# EAGLE design Fan-Module_80mm (EAGLE 9.2.2)
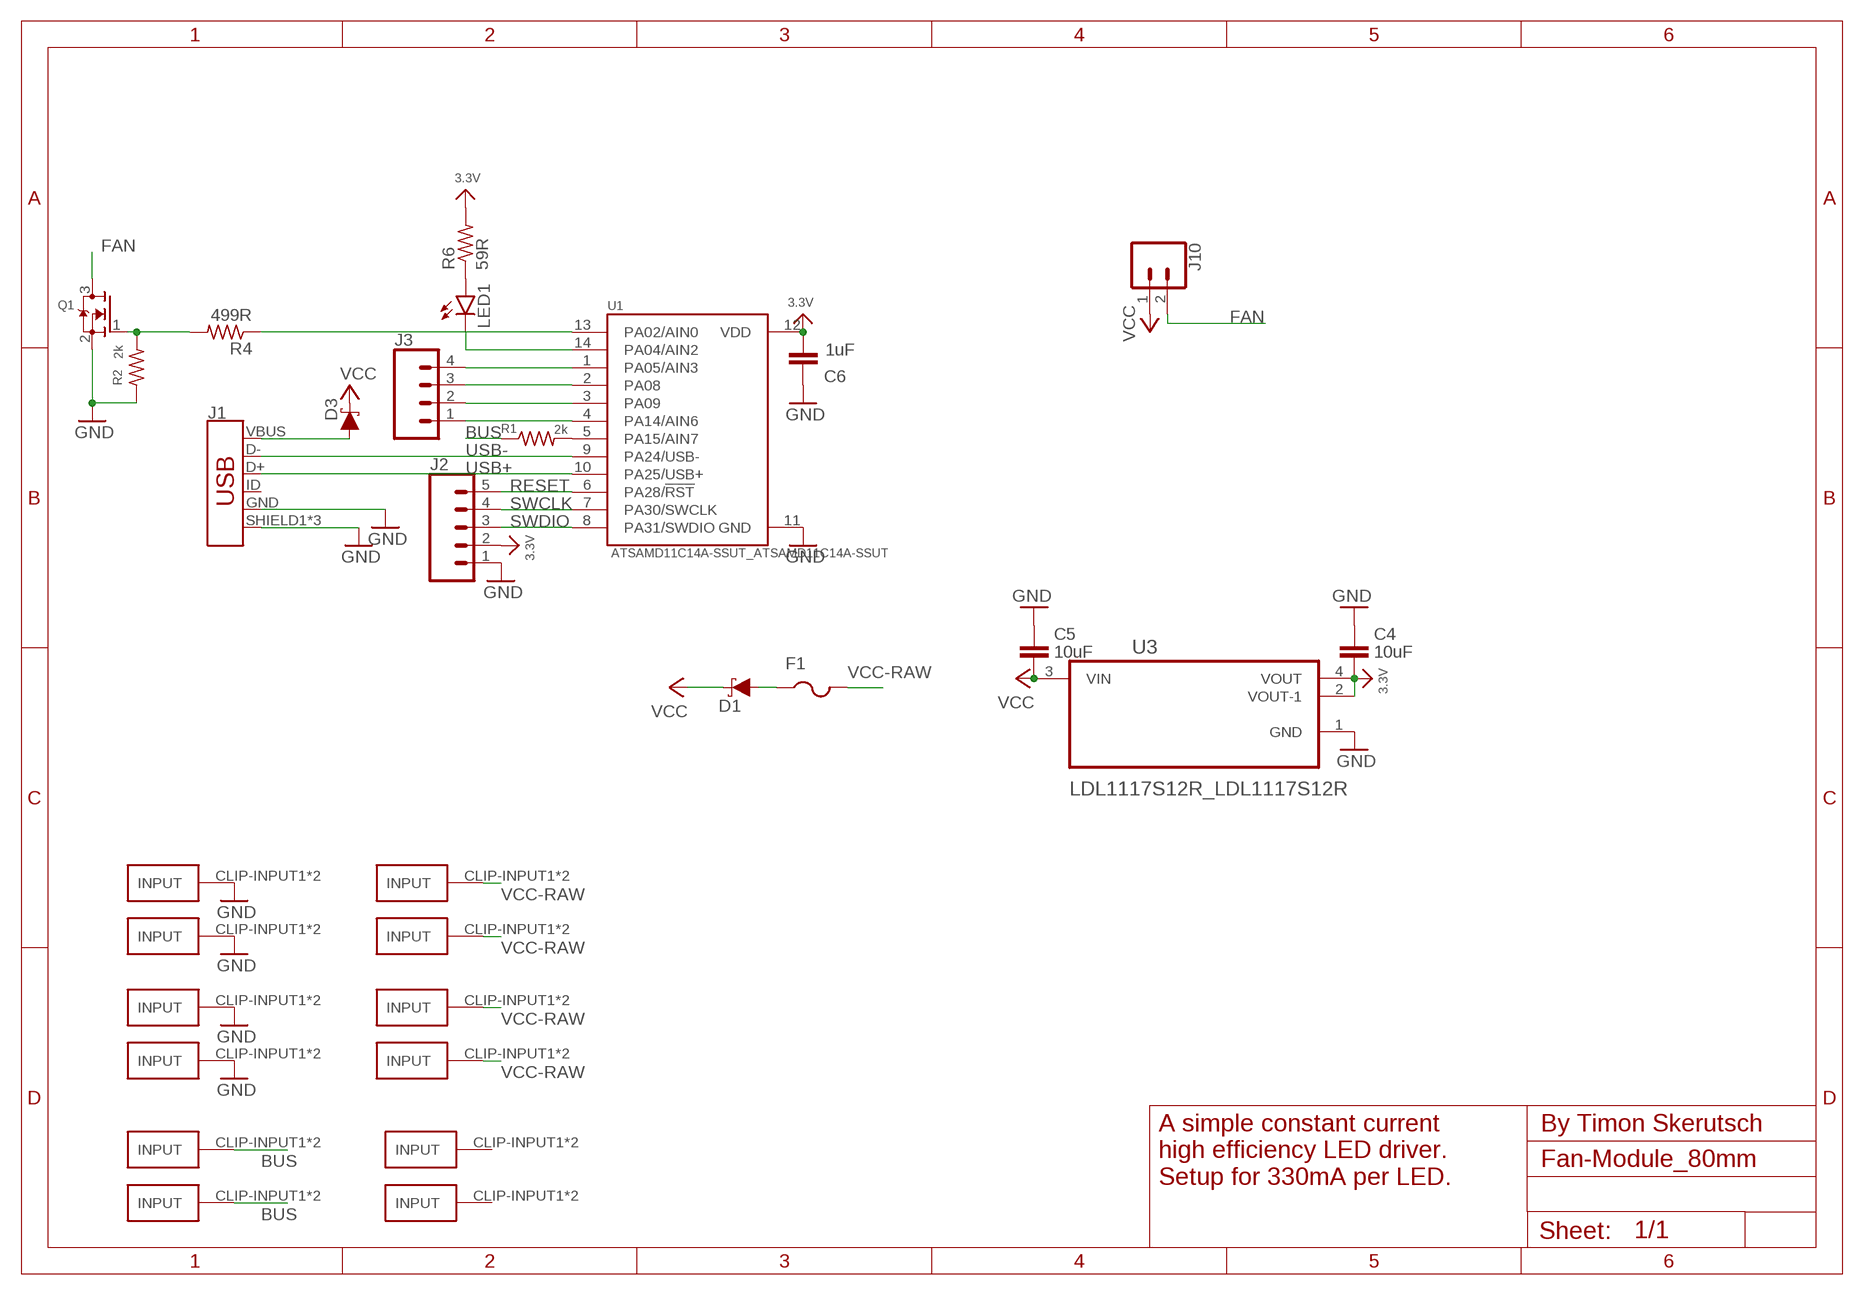
[diagram p0: schematic, sheet 1]

## Parts
C4  10uF  C-EUC0603  [C0603]
C5  10uF  C-EUC0603  [C0603]
C6  1uF  C-EUC0603  [C0603]
D1  3A/40V/500mV  DIODE-SCHOTTKY-B340A  [SMA-DIODE]
D3  3A/40V/500mV  DIODE-SCHOTTKY-B340A  [SMA-DIODE]
F1  PTCFUSE-1812  [1812]
GND-CLIP  FUSE-HOLDER-5X20MM  [FUSE-HOLDER-5X20MM]
GND-CLIP1  FUSE-HOLDER-5X20MM  [FUSE-HOLDER-5X20MM]
GND-CLIP2  FUSE-HOLDER-5X20MM  [FUSE-HOLDER-5X20MM]
GND-CLIP3  FUSE-HOLDER-5X20MM  [FUSE-HOLDER-5X20MM]
J1  USB_MICRO-B_FEMALE-SMT  [USB-B-MICRO-SMD]
J2  CONN_05  [1X05]
J3  CONN_04PTH  [1X04]
J10  CONN_02PTH3  [1X02_LONGPADS]
LED1  LEDCHIPLED_0805  [CHIPLED_0805]
PWM-CLIP  FUSE-HOLDER-5X20MM  [FUSE-HOLDER-5X20MM]
PWM-CLIP1  FUSE-HOLDER-5X20MM  [FUSE-HOLDER-5X20MM]
PWM-CLIP2  FUSE-HOLDER-5X20MM  [FUSE-HOLDER-5X20MM]
PWM-CLIP3  FUSE-HOLDER-5X20MM  [FUSE-HOLDER-5X20MM]
Q1  MOSFET-NWIDE  [SOT23-WIDE]
R1  2k  R-US_R1206  [R1206]
R2  2k  R-US_R1206  [R1206]
R4  499R  R-US_R0805  [R0805]
R6  59R  R-US_R0805  [R0805]
U1  ATSAMD11C14A-SSUT_ATSAMD11C14A-SSUT  [ATSAMD11C14A-SSUT_SOIC127P600X160-14N]
U3  LDL1117S12R_LDL1117S12R  [LDL1117S12R_SOT230P700X180-4N]
VCC-CLIP  FUSE-HOLDER-5X20MM  [FUSE-HOLDER-5X20MM]
VCC-CLIP1  FUSE-HOLDER-5X20MM  [FUSE-HOLDER-5X20MM]
VCC-CLIP2  FUSE-HOLDER-5X20MM  [FUSE-HOLDER-5X20MM]
VCC-CLIP3  FUSE-HOLDER-5X20MM  [FUSE-HOLDER-5X20MM]

## Nets
3.3V: C4.2 C6.2 J2.2 R6.2 U1.12(VDD) U3.2(VOUT-1) U3.4(VOUT)
BUS: PWM-CLIP1.CLIP-INPUT1(INPUT) PWM-CLIP1.CLIP-INPUT2(INPUT) PWM-CLIP.CLIP-INPUT1(INPUT) PWM-CLIP.CLIP-INPUT2(INPUT) R1.1
FAN: J10.2 Q1.3(D)
GND: C4.1 C5.1 C6.1 GND-CLIP1.CLIP-INPUT1(INPUT) GND-CLIP1.CLIP-INPUT2(INPUT) GND-CLIP2.CLIP-INPUT1(INPUT) GND-CLIP2.CLIP-INPUT2(INPUT) GND-CLIP3.CLIP-INPUT1(INPUT) GND-CLIP3.CLIP-INPUT2(INPUT) GND-CLIP.CLIP-INPUT1(INPUT) GND-CLIP.CLIP-INPUT2(INPUT) J1.GND J1.SHIELD1(SHIELD) J1.SHIELD2(SHIELD) J1.SHIELD3(SHIELD) J2.1 Q1.2(S) R2.1 U1.11(GND) U3.1(GND)
N$1: LED1.C U1.14(PA04/AIN2)
N$2: LED1.A R6.1
N$3: R1.2 U1.5(PA15/AIN7)
N$4: D3.A J1.VBUS
N$5: R4.1 U1.13(PA02/AIN0)
N$6: D1.A F1.1
N$7: J3.4 U1.1(PA05/AIN3)
N$8: Q1.1(G) R2.2 R4.2
N$9: J3.3 U1.2(PA08)
N$10: J3.2 U1.3(PA09)
N$11: J3.1 U1.4(PA14/AIN6)
RESET: J2.5 U1.6(PA28/!RST)
SWCLK: J2.4 U1.7(PA30/SWCLK)
SWDIO: J2.3 U1.8(PA31/SWDIO)
USB+: J1.D+ U1.10(PA25/USB+)
USB-: J1.D- U1.9(PA24/USB-)
VCC: C5.2 D1.C D3.C J10.1 U3.3(VIN)
VCC-RAW [VCC]: F1.2 VCC-CLIP1.CLIP-INPUT1(INPUT) VCC-CLIP1.CLIP-INPUT2(INPUT) VCC-CLIP2.CLIP-INPUT1(INPUT) VCC-CLIP2.CLIP-INPUT2(INPUT) VCC-CLIP3.CLIP-INPUT1(INPUT) VCC-CLIP3.CLIP-INPUT2(INPUT) VCC-CLIP.CLIP-INPUT1(INPUT) VCC-CLIP.CLIP-INPUT2(INPUT)
Unconnected: J1.ID PWM-CLIP2.CLIP-INPUT1(INPUT) PWM-CLIP2.CLIP-INPUT2(INPUT) PWM-CLIP3.CLIP-INPUT1(INPUT) PWM-CLIP3.CLIP-INPUT2(INPUT)

## Notes on the sheet
- By Timon Skerutsch
- A simple constant current
  high efficiency LED driver.
  Setup for 330mA per LED.

## Library data of the parts
C4-C6 = rcl:C-EU: CAPACITOR, European symbol; SPICEPREFIX: C
D1 D3 = SparkFun-DiscreteSemi:DIODE-SCHOTTKY: Schottky diode A Schottky diode is a semiconductor diode which has a low forward voltage drop and a very fast switching action.; PROD_ID: DIO-09886
F1 = adafruit:PTCFUSE: PTC fuses, resettable thermistors
GND-CLIP GND-CLIP1-GND-CLIP3 PWM-CLIP PWM-CLIP1-PWM-CLIP3 VCC-CLIP VCC-CLIP1-VCC-CLIP3 = timon-diverses:FUSE-HOLDER-5X20MM
J1 = SparkFun-Connectors:USB_MICRO-B: USB Type Micro-B Connector Male/female and PTH/SMT variants SparkFun Products: SparkFun microB USB Breakout <https://www.sparkfun.com/products/12035> SparkFun USB microB Plug Breakout <https://www.sparkfun.com/products/10031> SparkFun ESP8266 Thing <https://www.sparkfun.com/products/13231>; PROD_ID: CONN-11752
J2 = SparkFun-Connectors:CONN_05: Multi connection point. Often used as Generic Header-pin footprint for 0.1 inch spaced/style header connections On any of the 0.1 inch spaced packages, you can populate with these: Break Away Headers - Straight <https://www.sparkfun.com/products/116> (PRT-00116) Break Away Male Headers - Right Angle <https://www.sparkfun.com/products/553> (PRT-00553) Female Headers <https://www.sparkfun.com/products/115> (PRT-00115) Break Away Headers - Machine Pin <https://www.sparkfun.com/products/117> (PRT-00117) Break Away Female Headers - Swiss Machine Pin <https://www.sparkfun.com/products/743> (PRT-00743) For SCREWTERMINALS and SPRING TERMINALS visit here: Screw Terimnals on SparkFun.com <https://www.sparkfun.com/search/results?term=Screw+Terminals> (5mm/3.5mm/2.54mm spacing) This device is also useful as a general connection point to wire up your design to another part of your project. Our various solder wires solder well into these plated through hole pads. Hook-Up Wire - Assortment (Stranded, 22 AWG) <https://www.sparkfun.com/products/11375> (PRT-11375) Hook-Up Wire - Assortment (Solid Core, 22 AWG) <https://www.sparkfun.com/products/11367> (PRT-11367) View the entire wire category on our website here <https://www.sparkfun.com/categories/141> Special notes: Molex polarized connector foot print use with SKU : PRT-08231 with associated crimp pins and housings. 1MM SMD Version SKU: PRT-10208
J3 = SparkFun-Connectors:CONN_04: Multi connection point. Often used as Generic Header-pin footprint for 0.1 inch spaced/style header connections On any of the 0.1 inch spaced packages, you can populate with these: Break Away Headers - Straight <https://www.sparkfun.com/products/116> (PRT-00116) Break Away Male Headers - Right Angle <https://www.sparkfun.com/products/553> (PRT-00553) Female Headers <https://www.sparkfun.com/products/115> (PRT-00115) Break Away Headers - Machine Pin <https://www.sparkfun.com/products/117> (PRT-00117) Break Away Female Headers - Swiss Machine Pin <https://www.sparkfun.com/products/743> (PRT-00743) For SCREWTERMINALS and SPRING TERMINALS visit here: Screw Terimnals on SparkFun.com <https://www.sparkfun.com/search/results?term=Screw+Terminals> (5mm/3.5mm/2.54mm spacing) This device is also useful as a general connection point to wire up your design to another part of your project. Our various solder wires solder well into these plated through hole pads. Hook-Up Wire - Assortment (Stranded, 22 AWG) <https://www.sparkfun.com/products/11375> (PRT-11375) Hook-Up Wire - Assortment (Solid Core, 22 AWG) <https://www.sparkfun.com/products/11367> (PRT-11367) View the entire wire category on our website here <https://www.sparkfun.com/categories/141> Special notes: Molex polarized connector foot print use with SKU : PRT-08231 with associated crimp pins and housings. 1MM SMD Version SKU: PRT-10208; PROD_ID: CONN-09696
J10 = SparkFun-Connectors:CONN_02: Multi connection point. Often used as Generic Header-pin footprint for 0.1 inch spaced/style header connections On any of the 0.1 inch spaced packages, you can populate with these: Break Away Headers - Straight <https://www.sparkfun.com/products/116> (PRT-00116) Break Away Male Headers - Right Angle <https://www.sparkfun.com/products/553> (PRT-00553) Female Headers <https://www.sparkfun.com/products/115> (PRT-00115) Break Away Headers - Machine Pin <https://www.sparkfun.com/products/117> (PRT-00117) Break Away Female Headers - Swiss Machine Pin <https://www.sparkfun.com/products/743> (PRT-00743) For SCREWTERMINALS and SPRING TERMINALS visit here: Screw Terimnals on SparkFun.com <https://www.sparkfun.com/search/results?term=Screw+Terminals> (5mm/3.5mm/2.54mm spacing) This device is also useful as a general connection point to wire up your design to another part of your project. Our various solder wires solder well into these plated through hole pads. Hook-Up Wire - Assortment (Stranded, 22 AWG) <https://www.sparkfun.com/products/11375> (PRT-11375) Hook-Up Wire - Assortment (Solid Core, 22 AWG) <https://www.sparkfun.com/products/11367> (PRT-11367) View the entire wire category on our website here <https://www.sparkfun.com/categories/141> Special notes: Molex polarized connector foot print use with: PRT-08233 with associated crimp pins and housings. 2.54_SCREWTERM for use with PRT-10571. 3.5mm Screw Terminal footprints for PRT-08084 5mm Screw Terminal footprints for use with PRT-08432
LED1 = led:LED: LED OSRAM: - CHIPLED LG R971, LG N971, LY N971, LG Q971, LY Q971, LO R971, LY R971 LH N974, LH R974 LS Q976, LO Q976, LY Q976 LO Q996 - Hyper CHIPLED LW Q18S LB Q993, LB Q99A, LB R99A - SideLED LS A670, LO A670, LY A670, LG A670, LP A670 LB A673, LV A673, LT A673, LW A673 LH A674 LY A675 LS A676, LA A676, LO A676, LY A676, LW A676 LS A679, LY A679, LG A679 - Hyper Micro SIDELED® LS Y876, LA Y876, LO Y876, LY Y876 LT Y87S - SmartLED LW L88C, LW L88S LB L89C, LB L89S, LG L890 LS L89K, LO L89K, LY L89K LS L896, LA L896, LO L896, LY L896 - TOPLED LS T670, LO T670, LY T670, LG T670, LP T670 LSG T670, LSP T670, LSY T670, LOP T670, LYG T670 LG T671, LOG T671, LSG T671 LB T673, LV T673, LT T673, LW T673 LH T674 LS T676, LA T676, LO T676, LY T676, LB T676, LH T676, LSB T676, LW T676 LB T67C, LV T67C, LT T67C, LS T67K, LO T67K, LY T67K, LW E67C LS E67B, LA E67B, LO E67B, LY E67B, LB E67C, LV E67C, LT E67C LW T67C LS T679, LY T679, LG T679 LS T770, LO T770, LY T770, LG T770, LP T770 LB T773, LV T773, LT T773, LW T773 LH T774 LS E675, LA E675, LY E675, LS T675 LS T776, LA T776, LO T776, LY T776, LB T776 LHGB T686 LT T68C, LB T68C - Hyper Mini TOPLED® LB M676 - Mini TOPLED Santana® LG M470 LS M47K, LO M47K, LY M47K Source: http://www.osram.convergy.de LUXEON: - LUMILED® LXK2-PW12-R00, LXK2-PW12-S00, LXK2-PW14-U00, LXK2-PW14-V00 LXK2-PM12-R00, LXK2-PM12-S00, LXK2-PM14-U00 LXK2-PE12-Q00, LXK2-PE12-R00, LXK2-PE12-S00, LXK2-PE14-T00, LXK2-PE14-U00 LXK2-PB12-K00, LXK2-PB12-L00, LXK2-PB12-M00, LXK2-PB14-N00, LXK2-PB14-P00, LXK2-PB14-Q00 LXK2-PR12-L00, LXK2-PR12-M00, LXK2-PR14-Q00, LXK2-PR14-R00 LXK2-PD12-Q00, LXK2-PD12-R00, LXK2-PD12-S00 LXK2-PH12-R00, LXK2-PH12-S00 LXK2-PL12-P00, LXK2-PL12-Q00, LXK2-PL12-R00 Source: www.luxeon.com KINGBRIGHT: KA-3528ASYC Source: www.kingbright.com
Q1 = microbuilder:MOSFET-N: N-Channel Mosfet LEGEND VDS: Voltage Drain-Source ID: Drain Current RDS(ON): Drain-Source On-State Resistance VGS(TH): Gate-Source Threshold Voltage CISS: Drain-Source Input Capacitance SOT-23 Name VDS ID RDS(ON) VGS(TH) CISS Order Number 2N7002E 60V 260mA 2.5 Ohm 2.5V @ 250uA 26.7pF @ 25V 2N7002ET1GOSTR-ND BSH103 30V 850mA 400 mOhm 400mV @ 1mA 83pF @ 24V BSH103,235-ND BSS138 60V 320mA 1.6 Ohm 1.5V @ 250uA 50pF @ 10V Mouser: 771-BSS138PW115 DMN2075U-7 20V 4.2A 38 mOhm 1V @ 250 uA 594.3pF @ 10V DMN2075U-7DICT-ND * BSS138 good choice for I2C level-shifting
R1 R2 R4 R6 = rcl:R-US_: RESISTOR, American symbol; SPICEPREFIX: R
U1 = LED-Board:ATSAMD11C14A-SSUT_ATSAMD11C14A-SSUT: MCU 32-Bit SAM D11 ARM Cortex M0+ RISC 16KB Flash 1.8V/2.5V/3.3V 14-Pin SOIC T/R; AVAILABILITY: Good; DESCRIPTION: Cortex-M0+, 16KB FLASH, 4KB SRAM, USB - 14 SOIC, INDUSTRIAL, GREEN, 1.6-3.6V, 48MHz/ SOIC .150 (SS); MF: Microchip; MP: ATSAMD11C14A-SSUT; PACKAGE: SOIC-14 Microchip; PRICE: 1.18 USD
U3 = LDL1117S12R:LDL1117S12R_LDL1117S12R: None; AVAILABILITY: Good; DESCRIPTION: 1.2 A High PSRR low dropout linear voltage regulator; MF: STMicroelectronics; MP: LDL1117S12R; PACKAGE: SOT-223 STMicroelectronics; PRICE: 0.22 USD

## Net classes
1 VCC: clearance 0.508 mm

## Board
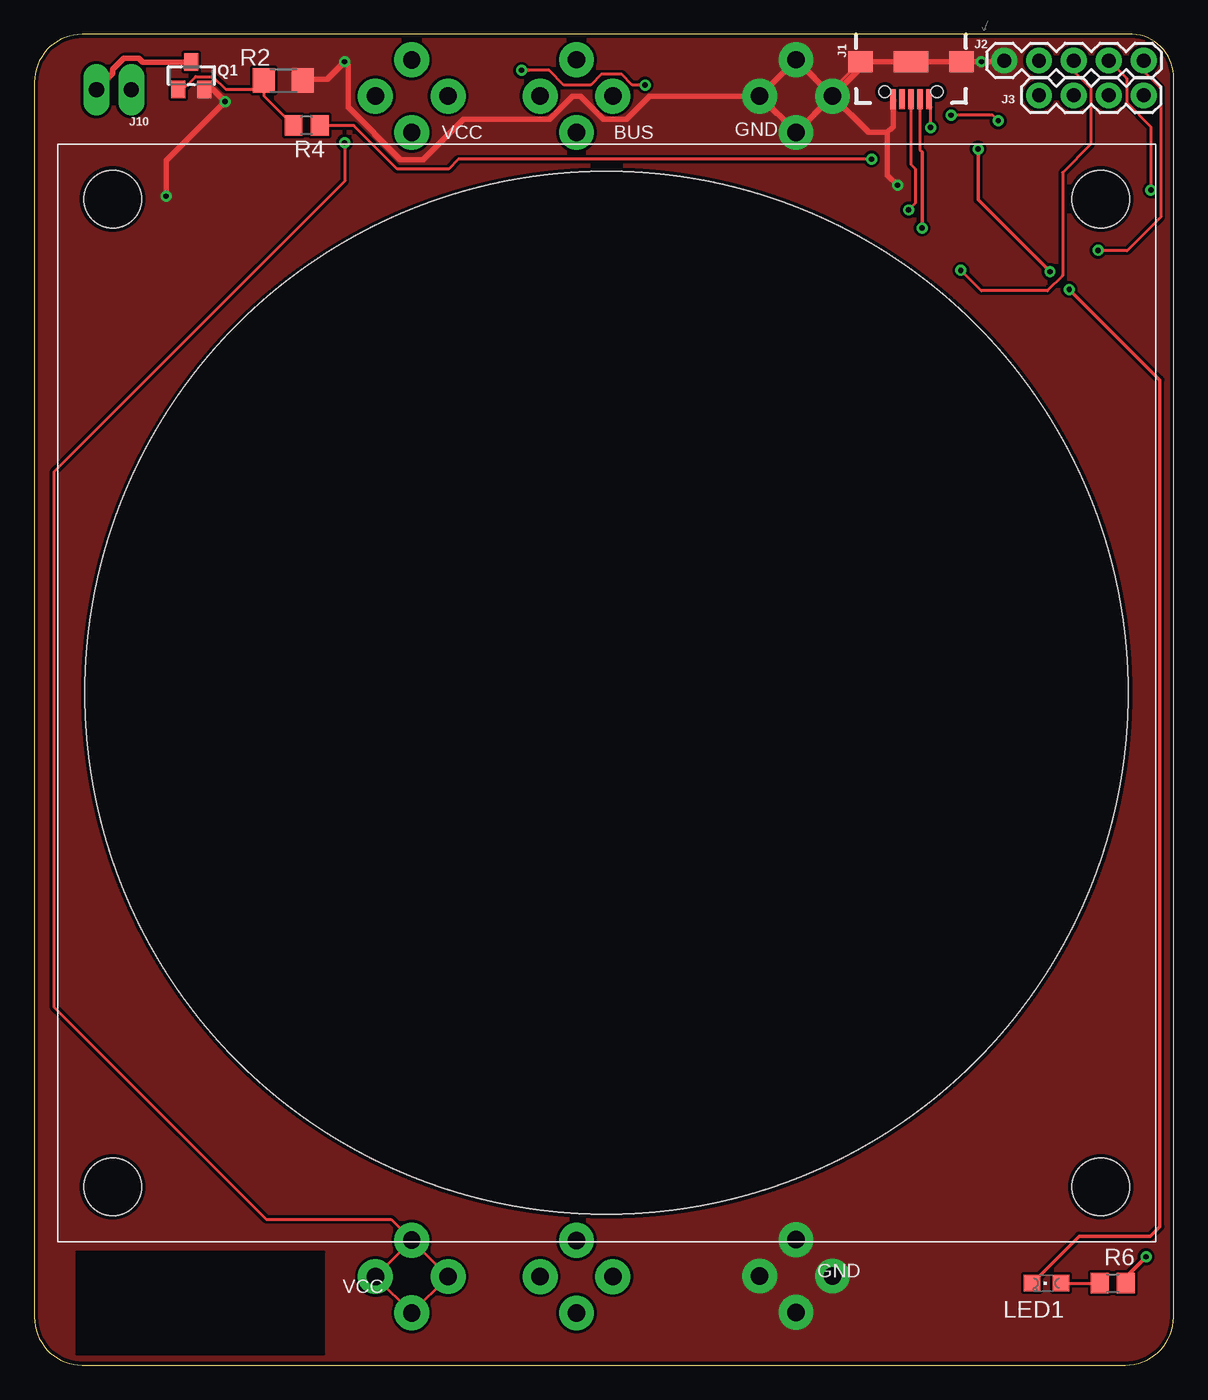
[diagram p1: board, top side]
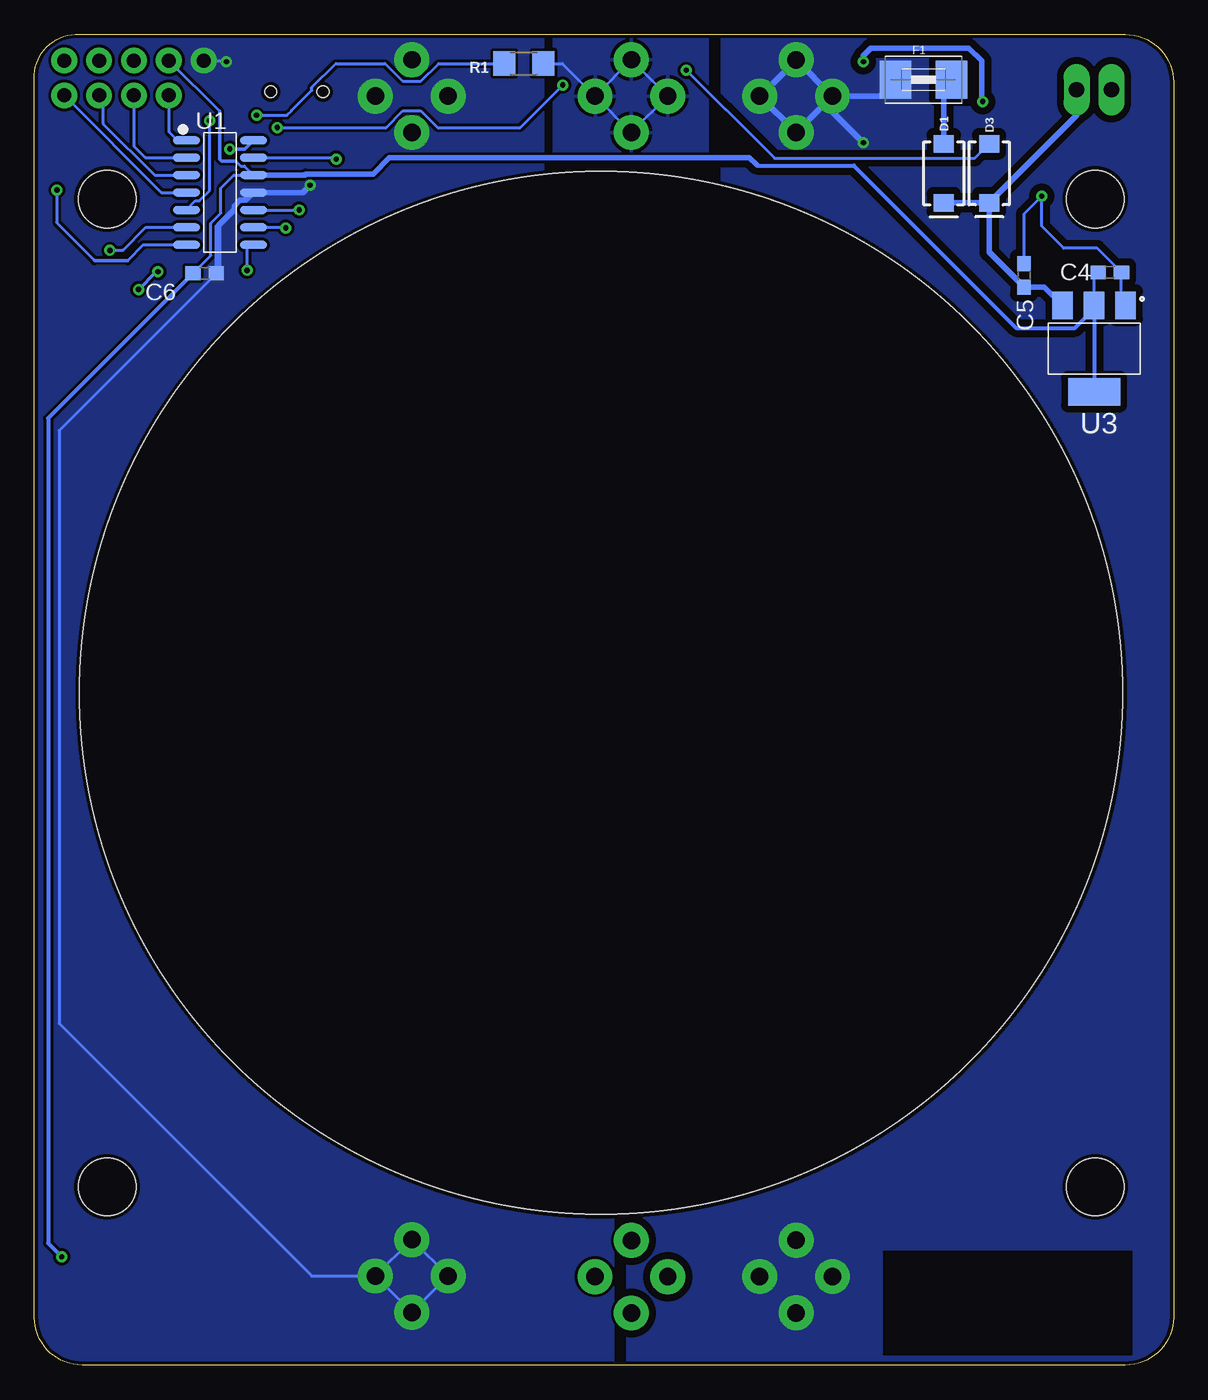
[diagram p2: board, bottom side, seen from below]

Size 83 x 97 mm. Coordinates in mm from the lower left corner, seen from the top.
Outline: 79.5,0 arc90 83,3.5 83,93.75 arc90 80.01,97 3.5,97 arc90 0,93.5 0,3.5 arc90 3.5,0 79.5,0
Copper layers (1*16): Top 0.035mm / dielectric 1.5mm / Bottom 0.035mm
Design rules "led_module *": minimum track width 8mil, minimum drill 15.5mil, track to track 8mil, track to pad 8mil, pad to pad 8mil, via to via 8mil, smd to smd 0mil, copper to edge 11mil, drill to drill 8mil, minimum pad ring 10mil, minimum via ring 8mil, stop-mask expansion 0.116840625mm, vias tented up to drill 20mil, thermal gap 10mil
tRestrict: area 3,0.8 to 21.1,8.2
bRestrict: area 3,0.8 to 21.1,8.2

### Footprints (pad centres in the part's own frame; a part is rotated, then mirrored left to right if it is on the bottom)
C0603 = smd 1.1 x 1: 1 -0.85,0; 2 0.85,0
SMA-DIODE = smd 1.27 x 1.47: A -2.15,0; C 2.15,0
1812 = smd 2.286 x 2.794: 1 -2.046,0; 2 2.046,0
FUSE-HOLDER-5X20MM = drill 1.27 pad 2.54: CLIP-INPUT1 -2.65,0; CLIP-INPUT2 2.65,0
USB-B-MICRO-SMD = smd 1.45 x 0.4: D+ 2.725,0; D- 2.725,0.65; GND 2.725,-1.3; ID 2.725,-0.65; VBUS 2.725,1.3 | smd 1.5 x 1.8: SHIELD1 0,3.685; SHIELD2 0,-3.685 | smd 1.5 x 2.5: SHIELD3 0,0 | hole 0.85: 2.2,1.9; 2.2,-1.9
1X05 = drill 1.016 pad 1.88: 1 0,0; 2 2.54,0; 3 5.08,0; 4 7.62,0; 5 10.16,0
1X04 = drill 1.016 pad 1.88: 1 0,0; 2 2.54,0; 3 5.08,0; 4 7.62,0
1X02_LONGPADS = drill 1.118 pad 1.88 long: 1 0,0; 2 2.54,0
CHIPLED_0805 = smd 1.2 x 1.2: A 0,-1.05; C 0,1.05
SOT23-WIDE = smd 1 x 1.27: 1 -0.95,-1; 2 0.95,-1; 3 0,1
R1206 = smd 1.6 x 1.803: 1 -1.422,0; 2 1.422,0
R0805 = smd 1.3 x 1.5: 1 -0.95,0; 2 0.95,0
ATSAMD11C14A-SSUT_SOIC127P600X160-14N = smd 2 x 0.6: 1 -2.45,3.81; 2 -2.45,2.54; 3 -2.45,1.27; 4 -2.45,0; 5 -2.45,-1.27; 6 -2.45,-2.54; 7 -2.45,-3.81; 8 2.45,-3.81; 9 2.45,-2.54; 10 2.45,-1.27; 11 2.45,0; 12 2.45,1.27; 13 2.45,2.54; 14 2.45,3.81
LDL1117S12R_SOT230P700X180-4N = smd 1.5 x 2: 1 -2.3,-3.15; 2 0,-3.15; 3 2.3,-3.15 | smd 3.8 x 2: 4 0,3.15
80MM-FAN = hole 76: 0,0 | hole 4.2: -36,36; 36,36; 36,-36; -36,-36

### Placement (x,y rotation side)
C4  4.64,79.65 180 bottom
C5  10.89,79.43 270 bottom
C6  70.59,79.59 180 bottom
D1  16.75,86.86 270 bottom
D3  13.43,86.87 270 bottom
F1  18.21,93.69 180 bottom
GND-CLIP  55.5,92.5 0 top
GND-CLIP1  55.5,6.5 90 top
GND-CLIP2  55.5,6.5 0 top
GND-CLIP3  55.5,92.5 90 top
J1  63.87,95 270 top
J2  70.66,95.09 0 top
J3  80.82,92.55 180 top
J10  7.07,92.96 180 top
LED1  73.75,5.98 90 top
PWM-CLIP  39.5,92.5 0 top
PWM-CLIP1  39.5,92.5 90 top
PWM-CLIP2  39.5,6.45 90 top
PWM-CLIP3  39.5,6.45 0 top
Q1  11.44,93.98 0 top
R1  47.34,94.87 180 bottom
R2  18.14,93.63 180 top
R4  19.84,90.35 180 top
R6  78.57,5.98 0 top
U1  69.47,85.47 0 bottom
U3  5.79,74.1 180 bottom
U10  [80MM-FAN]  41.7,49 0 top
VCC-CLIP  27.5,92.5 0 top
VCC-CLIP1  27.5,6.46 90 top
VCC-CLIP2  27.5,6.46 0 top
VCC-CLIP3  27.5,92.49 270 bottom

### Tracks (layer width: path | path; a pad name or v marks a point on that pad's centre or on a via)
3.3V  (via drill 0.39)
  Top 0.305: v81,7.9 79.52,6.42 R6.2
  Bottom 0.203: 68.33,87.76 67.97,87.4 67.69,87.4 U1.12 68.46,86.74 69.4,85.8 69.4,83.97 70.14,83.23 70.14,80.88 C6.2 | J2.2 69.51,91.39 | U3.2 5.79,79.35 C4.2
  Bottom 0.254: 68.33,87.76 69.36,87.76 69.5,87.9 69.5,91.39 69.51,91.39
  Bottom 0.305: C6.2 82,69.03 82,8.9 v81,7.9 | U3.4 U3.2 5.79,77 7.19,75.59 11.44,75.59 23.28,87.43 30.33,87.43 30.38,87.48
  Bottom 0.406: U1.12 63.3,86.74 63.23,86.81 58.32,86.81 57.12,88 30.9,88 30.38,87.48
BUS
  Top 0.203: PWM-CLIP1.CLIP-INPUT2 | PWM-CLIP.CLIP-INPUT1 | PWM-CLIP1.CLIP-INPUT1
  Bottom 0.203: R1.1 44.52,94.87 42.23,92.58 | 42.23,92.58 PWM-CLIP.CLIP-INPUT2 PWM-CLIP1.CLIP-INPUT1 PWM-CLIP.CLIP-INPUT1 PWM-CLIP1.CLIP-INPUT2 42.07,92.58 42.23,92.58
  pour Bottom (rank 3): 33.93,100.3 33.93,84.7 45.17,84.7 45.17,100.3
FAN
  Top 0.406: Q1.3 7.89,94.98 7.62,95.25 6.51,95.25 5.72,94.46 5.72,94.15 J10.2
GND  (via drill 0.39)
  Top 0.203: v69,95 J1.SHIELD1 J1.SHIELD3 60.3,95 J1.SHIELD2 58.15,92.97 GND-CLIP.CLIP-INPUT2 | GND-CLIP.CLIP-INPUT1 | 55.58,95.08 GND-CLIP3.CLIP-INPUT2 | 19.67,93.73 R2.1
  Top 0.305: 62.57,92.19 62.61,92.23 62.61,91.81 62.55,91.75
  Top 0.406: Q1.2 13.02,92.98 v13.9,92.1 9.6,87.8 v9.6,85.2 | 19.67,93.73 21.33,93.73 v22.6,95 22.87,94.73 22.87,91.67 26.68,87.86 28.32,87.86 31.28,90.82 37.54,90.82 39.22,92.5 39.78,92.5 41.46,90.82 43.16,90.82 44.84,92.5 GND-CLIP.CLIP-INPUT1 GND-CLIP3.CLIP-INPUT2 | GND-CLIP.CLIP-INPUT1 GND-CLIP3.CLIP-INPUT1 GND-CLIP.CLIP-INPUT2 | GND-CLIP.CLIP-INPUT2 55.58,95.08 | GND-CLIP.CLIP-INPUT2 60.3,94.65 60.3,95 | GND-CLIP.CLIP-INPUT2 60.8,89.85 62.15,89.85 | J1.SHIELD2 70.57,95 J2.1 | 62.15,89.85 62.58,90.28 62.58,92.12 62.6,92.15 | 62.15,89.85 62.15,86.75 v62.9,86
  Bottom 0.203: J2.1 69.09,95.09 v69,95 | C5.1 10.89,83.91 v9.6,85.2 9.6,83 8,81.4 5.54,81.4 C4.1 3.79,77.56 U3.1 | GND-CLIP2.CLIP-INPUT2 62.8,6.5 81.2,24.9 81.2,68.13 69.86,79.46 C6.1 69.74,83.06 67.33,85.47 67.2,85.47 U1.11 63.43,85.47 | GND-CLIP2.CLIP-INPUT2 GND-CLIP1.CLIP-INPUT2 GND-CLIP2.CLIP-INPUT1 GND-CLIP1.CLIP-INPUT1 GND-CLIP2.CLIP-INPUT2
  Bottom 0.406: v13.9,92.1 13.97,92.17 13.97,95.06 14.91,96 22.05,96 22.6,95.45 v22.6,95 | v62.9,86 63.43,85.47 67.2,85.47 | U1.11 67.59,84.9 68.02,84.9 68.43,84.49 68.43,84.23 69.58,83.08 69.58,79.75 69.86,79.46
  pour Top (rank 2, no thermals): -1,103.5 83.5,103.5 83.5,-10.5 -1,-10.5
  pour Bottom (rank 2, no thermals): 40.8,84.07 45.9,84.07 45.9,100.3 100.3,100.3 100.3,-3.2 40.8,-3.2
N$1  (via drill 0.39)
  Top 0.254: LED1.C 76.12,9.4 81.3,9.4 82,10.1 82,71.8 v75.4,78.4 | v74,79.7 68.76,84.94 v68.76,88.64
  Bottom 0.254: v75.4,78.4 74.1,79.7 v74,79.7 | v68.76,88.64 67.66,88.64 U1.14
N$2
  Top 0.203: LED1.A R6.1
N$3  (via drill 0.39)
  Top 0.203: v70.23,90.7 69.83,91.1 v66.8,91.1
  Bottom 0.203: U1.5 71.26,84.86 70.97,84.86 70.23,85.6 v70.23,90.7 | v66.8,91.1 64.6,91.1 64.25,91.45 64.19,91.5 62.77,92.92 62.77,93.13 61.04,94.87 57.45,94.87 56.15,93.57 54.85,93.57 53.55,94.87 R1.2
N$4  (via drill 0.39)
  Top 0.203: 65.17,91.8 65.17,92.2 | 65.17,92.2 J1.VBUS | v44.5,93.3 43.58,93.3 42.8,94.08 41.3,94.08 40.52,93.3 38.58,93.3 37.5,94.38 36.02,94.38 v35.5,94.38 | v65.3,90.2 65.3,92.07 65.17,92.2
  Top 0.254: 65.3,91.67 65.17,91.8
  Bottom 0.203: v44.5,93.3 47.6,90.2 53.62,90.2 54.85,91.42 56.15,91.42 57.37,90.2 v65.3,90.2 | v35.5,94.38 32.62,91.5 32.6,91.5 29.06,87.96 14.49,87.96 D3.A
N$5  (via drill 0.39)
  Top 0.203: v61,87.9 30.9,87.9 30.18,87.18 26.46,87.18 23.29,90.35 R4.1
  Bottom 0.203: U1.13 61.11,88.01 v61,87.9
N$6
  Bottom 0.406: F1.1 16.75,93.11 D1.A
N$7
  Bottom 0.203: J3.4 73.2,89.9 72.58,89.28 U1.1
N$8
  Top 0.203: Q1.1 10.82,92.98 11.76,93.92 13.01,93.92 13.95,92.98 16.08,92.98 R2.2 16.72,92.52 R4.2
N$9
  Bottom 0.203: J3.3 75.74,88.84 74.91,88.01 U1.2
N$10
  Bottom 0.203: J3.2 78,92.27 78,90.5 74.24,86.74 U1.3
N$11
  Bottom 0.203: J3.1 73.74,85.47 U1.4
RESET  (via drill 0.39)
  Top 0.203: v77.5,81.25 77.53,81.22 79.63,81.22 82.06,83.66 82.06,93.06 80.82,94.31 J2.5
  Bottom 0.203: v77.5,81.25 77.48,81.27 76.52,81.27 74.86,82.93 U1.6
SWCLK  (via drill 0.39)
  Top 0.203: J2.4 79.58,93.79 79.58,92.03 81.36,90.25 v81.36,85.64
  Bottom 0.203: 76.2,80.5 75.05,81.66 U1.7 | v81.36,85.64 81.38,85.62 81.38,83.28 78.65,80.55
  Bottom 0.254: 76.2,80.5 78.6,80.5 78.65,80.55
SWDIO  (via drill 0.39)
  Top 0.203: J2.3 75.74,94.31 76.98,93.06 76.98,88.99 74.92,86.93 74.92,79.42 73.8,78.3 69,78.3 v67.5,79.8
  Bottom 0.203: v67.5,79.8 67.5,81.5 67.34,81.66 U1.8
USB+  (via drill 0.39)
  Top 0.203: J1.D+ 63.87,87.53 64.2,87.2 64.2,84.7 v63.7,84.2
  Bottom 0.203: U1.10 v63.7,84.2
USB-  (via drill 0.39)
  Top 0.203: 64.42,92.17 J1.D- 64.52,88.56 64.68,88.4
  Top 0.254: 64.68,88.4 v64.68,82.88
  Bottom 0.203: U1.9 64.73,82.93 v64.68,82.88
VCC
  Bottom 0.203: C5.2
  Bottom 0.406: D3.C 7.07,91.09 J10.1 | D1.C 16.74,84.72 D3.C | U3.3 9.42,78.58 C5.2 13.43,81.13 D3.C
VCC-RAW  (via drill 0.39)
  Top 0.203: v22.6,89.1 22.6,86.28 1.42,65.1 1.42,26.1 16.9,10.62 25.99,10.62 27.25,9.35 | 27.25,9.35 VCC-CLIP1.CLIP-INPUT2 VCC-CLIP2.CLIP-INPUT1 VCC-CLIP1.CLIP-INPUT1 VCC-CLIP2.CLIP-INPUT2 27.26,9.35 27.25,9.35
  Bottom 0.203: 24.7,92.5 VCC-CLIP.CLIP-INPUT1 | VCC-CLIP3.CLIP-INPUT1 VCC-CLIP.CLIP-INPUT2 30.12,92.47 VCC-CLIP3.CLIP-INPUT2 | VCC-CLIP3.CLIP-INPUT2 | VCC-CLIP3.CLIP-INPUT2 27.5,89.86
  Bottom 0.406: F1.2 21.45,92.5 24.7,92.5 | VCC-CLIP.CLIP-INPUT1 24.85,91.35 v22.6,89.1 | VCC-CLIP.CLIP-INPUT1 VCC-CLIP3.CLIP-INPUT1 27.5,95.1 30.12,92.47 | VCC-CLIP.CLIP-INPUT2 VCC-CLIP3.CLIP-INPUT2 | VCC-CLIP3.CLIP-INPUT2 27.5,89.86 VCC-CLIP.CLIP-INPUT1
  pour Bottom (no thermals): -8.93,100.34 -8.93,-3.21 39.78,-3.21 39.78,84.08 32.92,84.08 32.92,100.34

### Text on the board
tNames: VCC | BUS | GND | GND | VCC